# EAGLE design main_board (EAGLE 9.4.2)
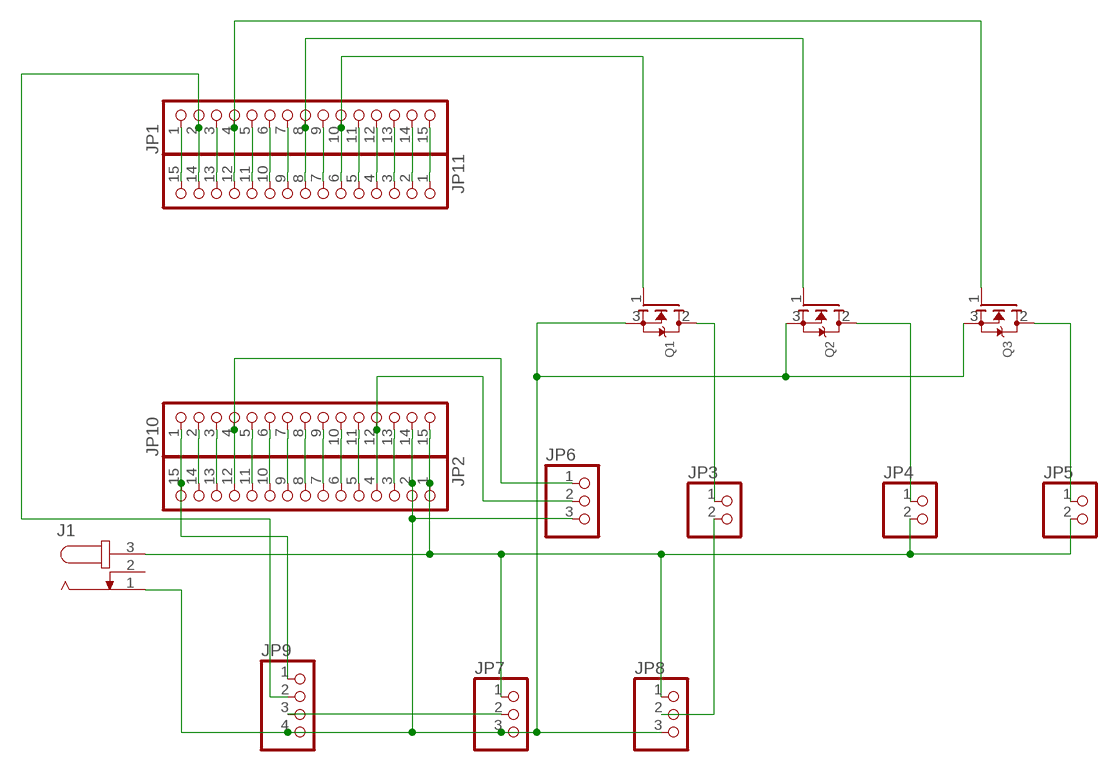
[diagram p0: schematic, sheet 1]

## Parts
J1  JACK-PLUG1  [SPC4078]
JP1  PINHD-1X15  [1X15]
JP2  PINHD-1X15  [1X15]
JP3  PINHD-1X2  [1X02]
JP4  PINHD-1X2  [1X02]
JP5  PINHD-1X2  [1X02]
JP6  PINHD-1X3  [1X03]
JP7  PINHD-1X3  [1X03]
JP8  PINHD-1X3  [1X03]
JP9  PINHD-1X4  [1X04]
JP10  PINHD-1X15  [1X15]
JP11  PINHD-1X15  [1X15]
Q1  MOSFET-NGDS_TO220V  [TO220V]
Q2  MOSFET-NGDS_TO220V  [TO220V]
Q3  MOSFET-NGDS_TO220V  [TO220V]

## Nets
N$1: JP2.15 JP9.1 JP10.1
N$2: JP2.14 JP10.2
N$3: JP2.13 JP10.3
N$4: JP2.12 JP6.1 JP10.4
N$5: JP2.11 JP10.5
N$6: JP2.10 JP10.6
N$7: JP2.9 JP10.7
N$8: JP2.8 JP10.8
N$9: JP2.7 JP10.9
N$10: JP2.6 JP10.10
N$11: JP2.5 JP10.11
N$12: JP2.4 JP6.2 JP10.12
N$13: JP2.3 JP10.13
N$14: J1.1 JP2.2 JP6.3 JP7.3 JP8.3 JP9.4 JP10.14 Q1.3(S) Q2.3(S) Q3.3(S)
N$15: J1.3 JP2.1 JP4.2 JP5.2 JP7.1 JP8.1 JP10.15
N$16: JP1.15 JP11.1
N$17: JP1.14 JP11.2
N$18: JP1.13 JP11.3
N$19: JP1.12 JP11.4
N$20: JP1.11 JP11.5
N$21: JP1.10 JP11.6 Q1.1(G)
N$22: JP1.9 JP11.7
N$23: JP1.8 JP11.8 Q2.1(G)
N$24: JP1.7 JP11.9
N$25: JP1.6 JP11.10
N$26: JP1.5 JP11.11
N$27: JP1.4 JP11.12 Q3.1(G)
N$28: JP1.3 JP11.13
N$29: JP1.2 JP9.2 JP11.14
N$30: JP1.1 JP11.15
N$31: JP3.1 Q1.2(D)
N$32: JP4.1 Q2.2(D)
N$33: JP5.1 Q3.2(D)
N$35: JP3.2 JP8.2
N$36: JP7.2 JP9.3
Unconnected: J1.2

## Library data of the parts
J1 = con-jack:JACK-PLUG: DC POWER JACK Power Jack, DC, Right Angle, Through Hole, Rated 5A at 16VDC, PC Terminals Distributor: Farnell (www.Farnell.de) Drawing: 84N1161.pdf / 84N1162.pdf Manufacturer: SPC Technology (www.spctechnology.com) Type: SPC4077 / SPC 4078; OC_FARNELL: unknown; OC_NEWARK: unknown
JP1 JP2 JP10 JP11 = pinhead:PINHD-1X15: PIN HEADER
JP3-JP5 = pinhead:PINHD-1X2: PIN HEADER
JP6-JP8 = pinhead:PINHD-1X3: PIN HEADER
JP9 = pinhead:PINHD-1X4: PIN HEADER
Q1-Q3 = adafruit:MOSFET-N: N-Channel Mosfet 2N7002E - 60V 260mA SOT23 [Digikey: 2N7002ET1GOSTR-ND] - REEL BSH103 - 30V 850mA SOT23 [Digikey: 568-5013-1-ND]

## Board
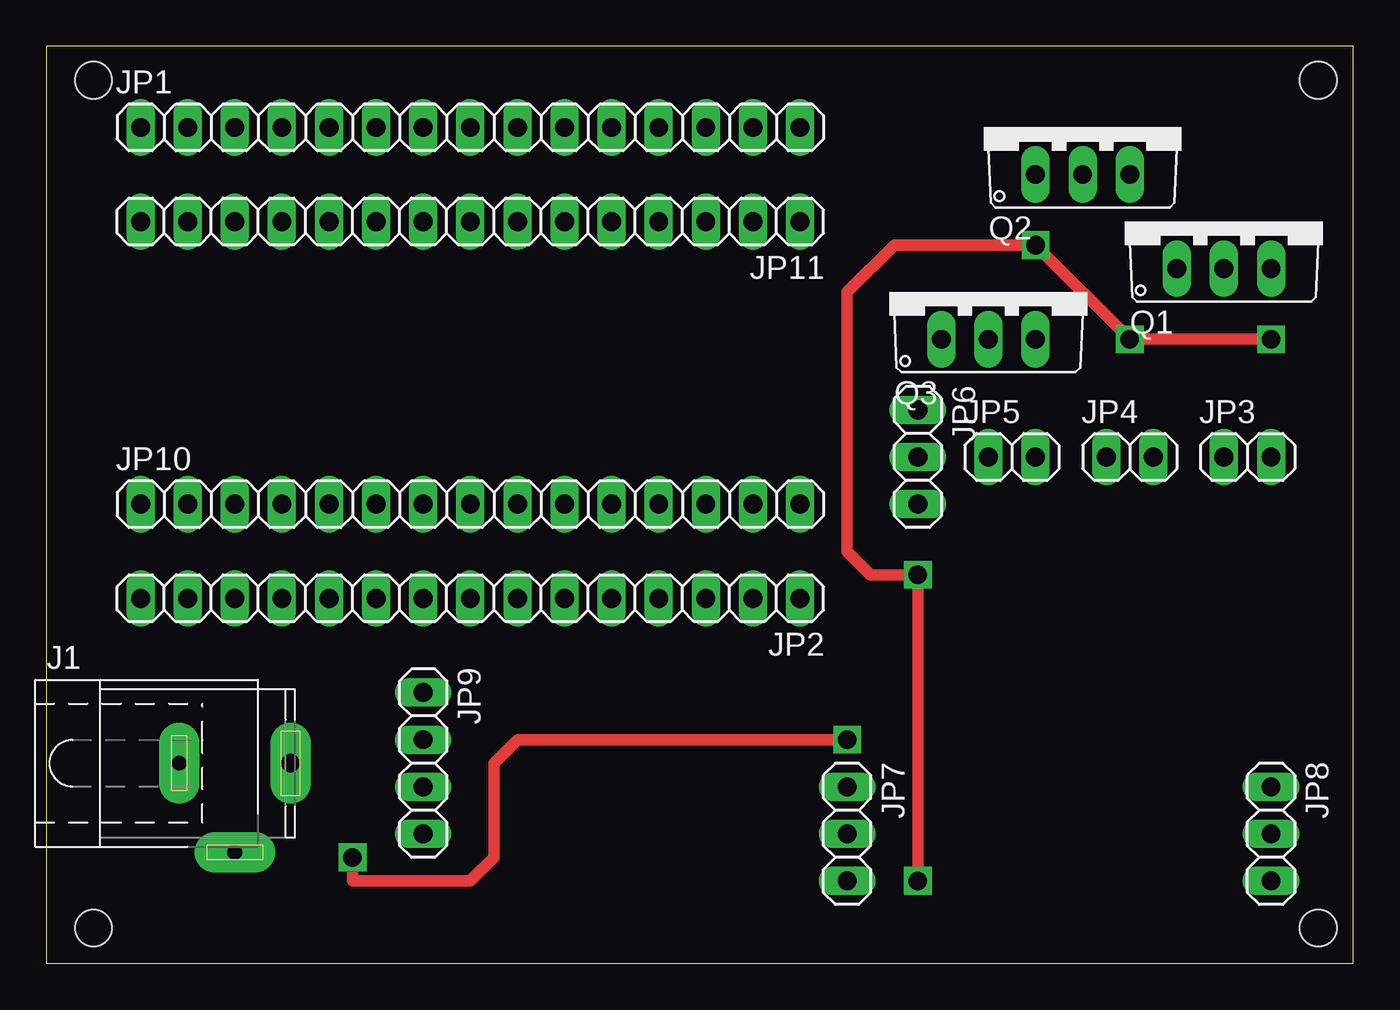
[diagram p1: board, top side]
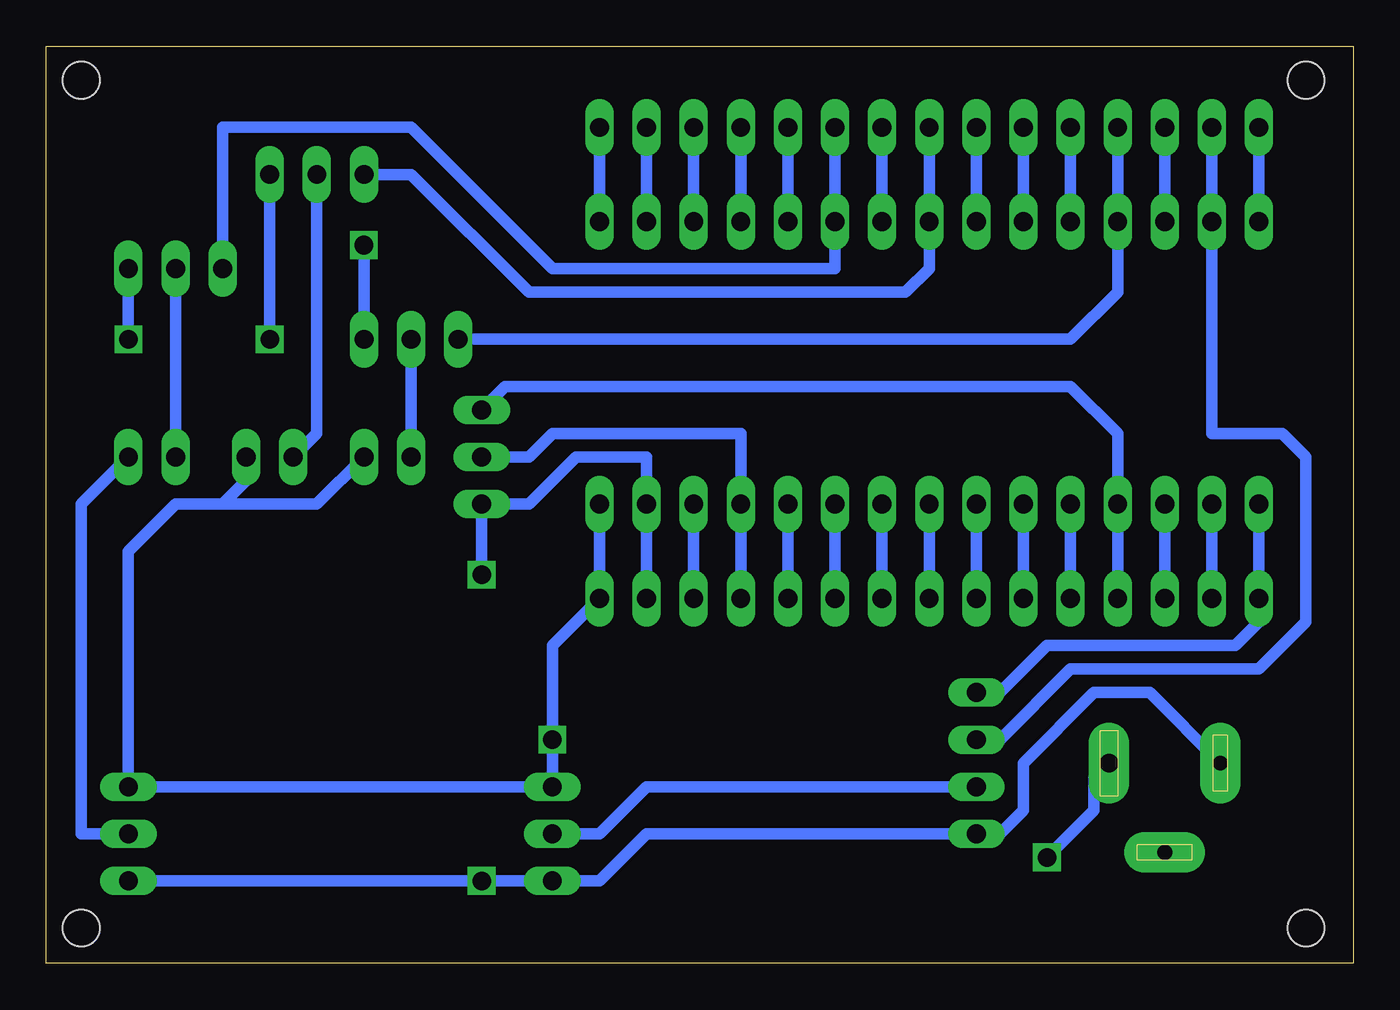
[diagram p2: board, bottom side, seen from below]

Size 70.47 x 49.45 mm. Coordinates in mm from the lower left corner, seen from the top.
Outline: 0,0 70.47,0 70.47,49.45 0,49.45 0,0
Copper layers (1*16): Top 0.035mm / dielectric 1.5mm / Bottom 0.035mm
Design rules "default": minimum track width 6mil, minimum drill 0.35mm, track to track 6mil, track to pad 6mil, pad to pad 6mil, via to via 6mil, smd to smd 6mil, copper to edge 40mil, drill to drill 6mil, minimum pad ring 10mil, minimum via ring 8mil, stop-mask expansion 4mil, vias tented up to drill 0mil, thermal gap 10mil
Holes 2 mm at 2.54,47.62 2.54,1.9 68.58,1.9 68.58,47.62

### Footprints (pad centres in the part's own frame; a part is rotated, then mirrored left to right if it is on the bottom)
SPC4078 = drill 0.8 pad 2.184 long: 1 -3,0; 2 0,-4.8 | drill 1 pad 2.184 long: 3 3,0
1X15 = drill 1.016 long: 1 -17.78,0; 2 -15.24,0; 3 -12.7,0; 4 -10.16,0; 5 -7.62,0; 6 -5.08,0; 7 -2.54,0; 8 0,0; 9 2.54,0; 10 5.08,0; 11 7.62,0; 12 10.16,0; 13 12.7,0; 14 15.24,0; 15 17.78,0
1X02 = drill 1.016 long: 1 -1.27,0; 2 1.27,0
1X03 = drill 1.016 long: 1 -2.54,0; 2 0,0; 3 2.54,0
1X04 = drill 1.016 long: 1 -3.81,0; 2 -1.27,0; 3 1.27,0; 4 3.81,0
TO220V = drill 1.016 long: 1 -2.54,-2.54; 2 0,-2.54; 3 2.54,-2.54

### Placement (x,y rotation side)
J1  10.16,10.79 0 top
JP1  22.86,45.09 0 top
JP2  22.86,19.69 180 top
JP3  64.77,27.3 0 top
JP4  58.42,27.3 0 top
JP5  52.07,27.3 0 top
JP6  46.99,27.3 270 top
JP7  43.18,6.99 270 top
JP8  66.04,6.99 270 top
JP9  20.32,10.79 270 top
JP10  22.86,24.77 0 top
JP11  22.86,40 180 top
Q1  63.5,40 0 top
Q2  55.88,45.09 0 top
Q3  50.8,36.2 0 top

### Tracks (layer width: path | path; a pad name or v marks a point on that pad's centre or on a via)
N$1
  Bottom 0.61: JP10.1 JP2.15 5.08,18.41 6.35,17.15 16.51,17.15 19.05,14.6 JP9.1
N$2
  Bottom 0.61: JP10.2 JP2.14
N$3
  Bottom 0.61: JP10.3 JP2.13
N$4
  Bottom 0.61: JP2.12 JP10.4 12.7,28.57 15.24,31.11 45.72,31.11 JP6.1
N$5
  Bottom 0.61: JP10.5 JP2.11
N$6
  Bottom 0.61: JP10.6 JP2.10
N$7
  Bottom 0.61: JP10.7 JP2.9
N$8
  Bottom 0.61: JP10.8 JP2.8
N$9
  Bottom 0.61: JP10.9 JP2.7
N$10
  Bottom 0.61: JP10.10 JP2.6
N$11
  Bottom 0.61: JP10.11 JP2.5
N$12
  Bottom 0.61: JP2.4 JP10.12 33.02,28.57 43.18,28.57 44.45,27.3 JP6.2
N$13
  Bottom 0.61: JP10.13 JP2.3
N$14  (via drill 1 pad 1.3)
  Top 0.61: v46.99,4.45 v46.99,20.95 44.45,20.95 43.18,22.23 43.18,36.2 45.72,38.73 v53.34,38.73 v58.42,33.66 v66.04,33.66
  Bottom 0.61: JP2.2 JP10.14 38.1,27.3 41.91,27.3 44.45,24.77 JP6.3 v46.99,20.95 | J1.1 10.97,14.6 13.97,14.6 17.78,10.79 17.78,8.26 19.05,6.99 JP9.4 38.1,6.99 40.64,4.45 JP7.3 v46.99,4.45 JP8.3 | Q1.3 v66.04,33.66 | Q2.3 v58.42,33.66 | Q3.3 v53.34,38.73
N$15  (via drill 1 pad 1.3)
  Top 0.61: v16.51,5.72 16.51,4.45 22.86,4.45 24.13,5.72 24.13,10.79 25.4,12.06 v43.18,12.06
  Bottom 0.61: JP10.15 JP2.1 43.18,17.15 v43.18,12.06 JP7.1 JP8.1 66.04,22.23 63.5,24.77 60.96,24.77 | J1.3 13.97,9.99 13.97,8.26 v16.51,5.72 | 60.96,24.77 59.69,26.03 JP4.2 | 60.96,24.77 55.88,24.77 JP5.2
N$16
  Bottom 0.61: JP11.1 JP1.15
N$17
  Bottom 0.61: JP1.14 JP11.2
N$18
  Bottom 0.61: JP11.3 JP1.13
N$19
  Bottom 0.61: JP1.12 JP11.4
N$20
  Bottom 0.61: JP11.5 JP1.11
N$21
  Bottom 0.61: JP1.10 JP11.6 27.94,37.46 43.18,37.46 50.8,45.09 60.96,45.09 Q1.1
N$22
  Bottom 0.61: JP11.7 JP1.9
N$23
  Bottom 0.61: JP1.8 JP11.8 22.86,37.46 24.13,36.2 44.45,36.2 50.8,42.55 Q2.1
N$24
  Bottom 0.61: JP11.9 JP1.7
N$25
  Bottom 0.61: JP1.6 JP11.10
N$26
  Bottom 0.61: JP11.11 JP1.5
N$27
  Bottom 0.61: JP1.4 JP11.12 12.7,36.2 15.24,33.66 Q3.1
N$28
  Bottom 0.61: JP11.13 JP1.3
N$29
  Bottom 0.61: JP1.2 JP11.14 7.62,28.57 3.81,28.57 2.54,27.3 2.54,18.41 5.08,15.88 15.24,15.88 19.05,12.06 JP9.2
N$30
  Bottom 0.61: JP11.15 JP1.1
N$31
  Bottom 0.61: JP3.1 Q1.2
N$32
  Bottom 0.61: Q2.2 55.88,28.57 JP4.1
N$33
  Bottom 0.61: Q3.2 JP5.1
N$35
  Bottom 0.61: JP8.2 68.58,6.99 68.58,24.77 JP3.2
N$36
  Bottom 0.61: JP9.3 38.1,9.53 40.64,6.99 JP7.2